# EAGLE design one_Mhz (EAGLE 7.7.0)
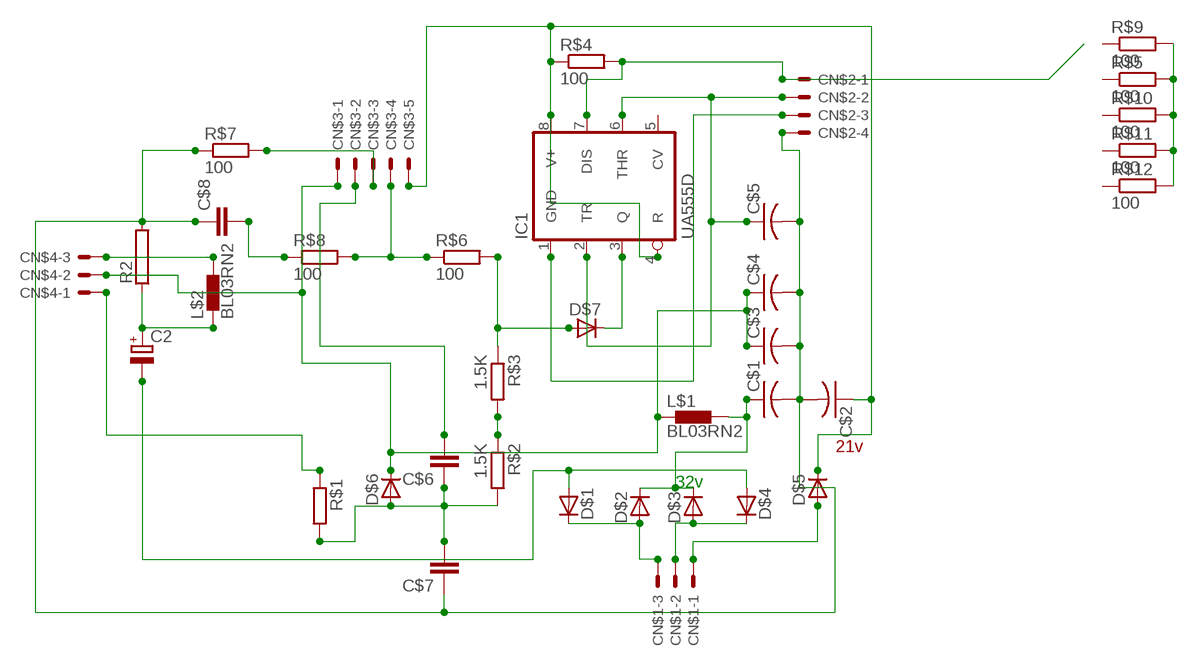
[diagram p0: schematic, sheet 1]

## Parts
C2  CPOL-EUSANYO_H  [SANYO-OSCON_H]
C$1  C-US050-075X075  [C050-075X075]
C$2  C-US050-075X075  [C050-075X075]
C$3  C-US025-050X050  [C025-050X050]
C$4  C-US025-050X050  [C025-050X050]
C$5  C-US025-050X050  [C025-050X050]
C$6  C7.5/3  [C7.5B3]
C$7  C7.5/3  [C7.5B3]
C$8  C2.5/5  [C2.5-5]
CN$1  KK-156-3  [KK-156-3]
CN$2  KK-156-4  [KK-156-4]
CN$3  KK-156-5  [KK-156-5]
CN$4  KK-156-3  [KK-156-3]
D$1  D-SOD-87  [SOD87]
D$2  D-SOD-87  [SOD87]
D$3  D-SOD-87  [SOD87]
D$4  D-SOD-87  [SOD87]
D$5  D-SOD-87  [SOD87]
D$6  D-SOD-87  [SOD87]
D$7  D-SOD-87  [SOD87]
IC1  UA555D  [SO08]
L$1  BL03RN2  [BL03RN2]
L$2  BL03RN2  [BL03RN2]
R2  RAC01  [AC01]
R$1  R-EU_R0603  [R0603]
R$2  1.5K  R-EU_R0603  [R0603]
R$3  1.5K  R-EU_R0603  [R0603]
R$4  100  R-EU_R0603  [R0603]
R$5  100  R-EU_R0603  [R0603]
R$6  100  R-EU_R0603  [R0603]
R$7  100  R-EU_R0603  [R0603]
R$8  100  R-EU_R0603  [R0603]
R$9  100  R-EU_R0603  [R0603]
R$10  100  R-EU_R0603  [R0603]
R$11  100  R-EU_R0603  [R0603]
R$12  100  R-EU_R0603  [R0603]

## Nets
N$1: C$3.1 C$4.1 CN$3.1 CN$4.2 D$6.1(C) L$1.1
N$2: CN$1.2 D$3.2(A) D$4.1(C)
N$6: CN$1.3 D$1.1(C) D$2.2(A)
N$7: C2.- D$1.2(A) D$4.2(A)
N$9: CN$1.1 D$5.2(A)
N$12: C$1.2 C$2.2 C$3.2 C$4.2 C$5.2 C$7.1 C$8.1 CN$2.4 R2.2 R$7.1
N$13: R$2.1 R$3.2
N$14: D$7.2(A) R$3.1 R$6.2
N$15: D$7.1(C) IC1.3(Q)
N$16: CN$3.4 R$6.1 R$8.2
N$17: C$8.2 R$8.1
N$19: C$5.1 CN$2.2 IC1.2(TR) IC1.6(THR)
N$20: CN$3.3 R$7.2
N$21: CN$4.3 L$2.2
N$22: C2.+ L$2.1 R2.1
N$23: R$5.2 R$9.2 R$10.2 R$11.2 R$12.2
N$24: C$6.2 CN$3.2
N$26: C$6.1 C$7.2 D$6.2(A) R$1.2 R$2.2
N$27: C$1.1 D$2.1(C) D$3.1(C) L$1.2
N$28: C$2.1 CN$3.5 D$5.1(C) IC1.4(R) IC1.8(V+) R$4.1
N$33: CN$4.1 R$1.1
N$35: CN$2.1 IC1.7(DIS) R$4.2
N$37: CN$2.3 IC1.1(GND)
Unconnected: IC1.5(CV) R$5.1 R$9.1 R$10.1 R$11.1 R$12.1

## Notes on the sheet
- 21v
- 32v

## Library data of the parts
C2 = rcl:CPOL-EU: POLARIZED CAPACITOR, European symbol
C$1-C$5 = resistor:C-US: CAPACITOR, American symbol
C$6-C$8 = capacitor-wima:C: CAPACITOR naming: grid - package width
CN$1 CN$4 = con-molex:KK-156-3: KK 156 HEADER Source: http://www.molex.com/pdm_docs/sd/026604100_sd.pdf; OC_FARNELL: unknown; OC_NEWARK: unknown
CN$2 = con-molex:KK-156-4: KK 156 HEADER Source: http://www.molex.com/pdm_docs/sd/026604100_sd.pdf; OC_FARNELL: unknown; OC_NEWARK: unknown
CN$3 = con-molex:KK-156-5: KK 156 HEADER Source: http://www.molex.com/pdm_docs/sd/026604100_sd.pdf; OC_FARNELL: unknown; OC_NEWARK: unknown
D$1-D$7 = semicon-smd-ipc:D-: DIODE unfilled
IC1 = linear:*555: TIMER
L$1 L$2 = inductors:BL0: Noise Suppression Products/EMI Suppression Filters, Lead EMIFIL(R) Inductor Type Source: http://www.murata.com .. BL01RN1_DS.pdf
R2 = resistor-power:R: Power Resitor; OC_FARNELL: unknown; OC_NEWARK: unknown
R$1-R$12 = rcl:R-EU_: RESISTOR, European symbol

## Board
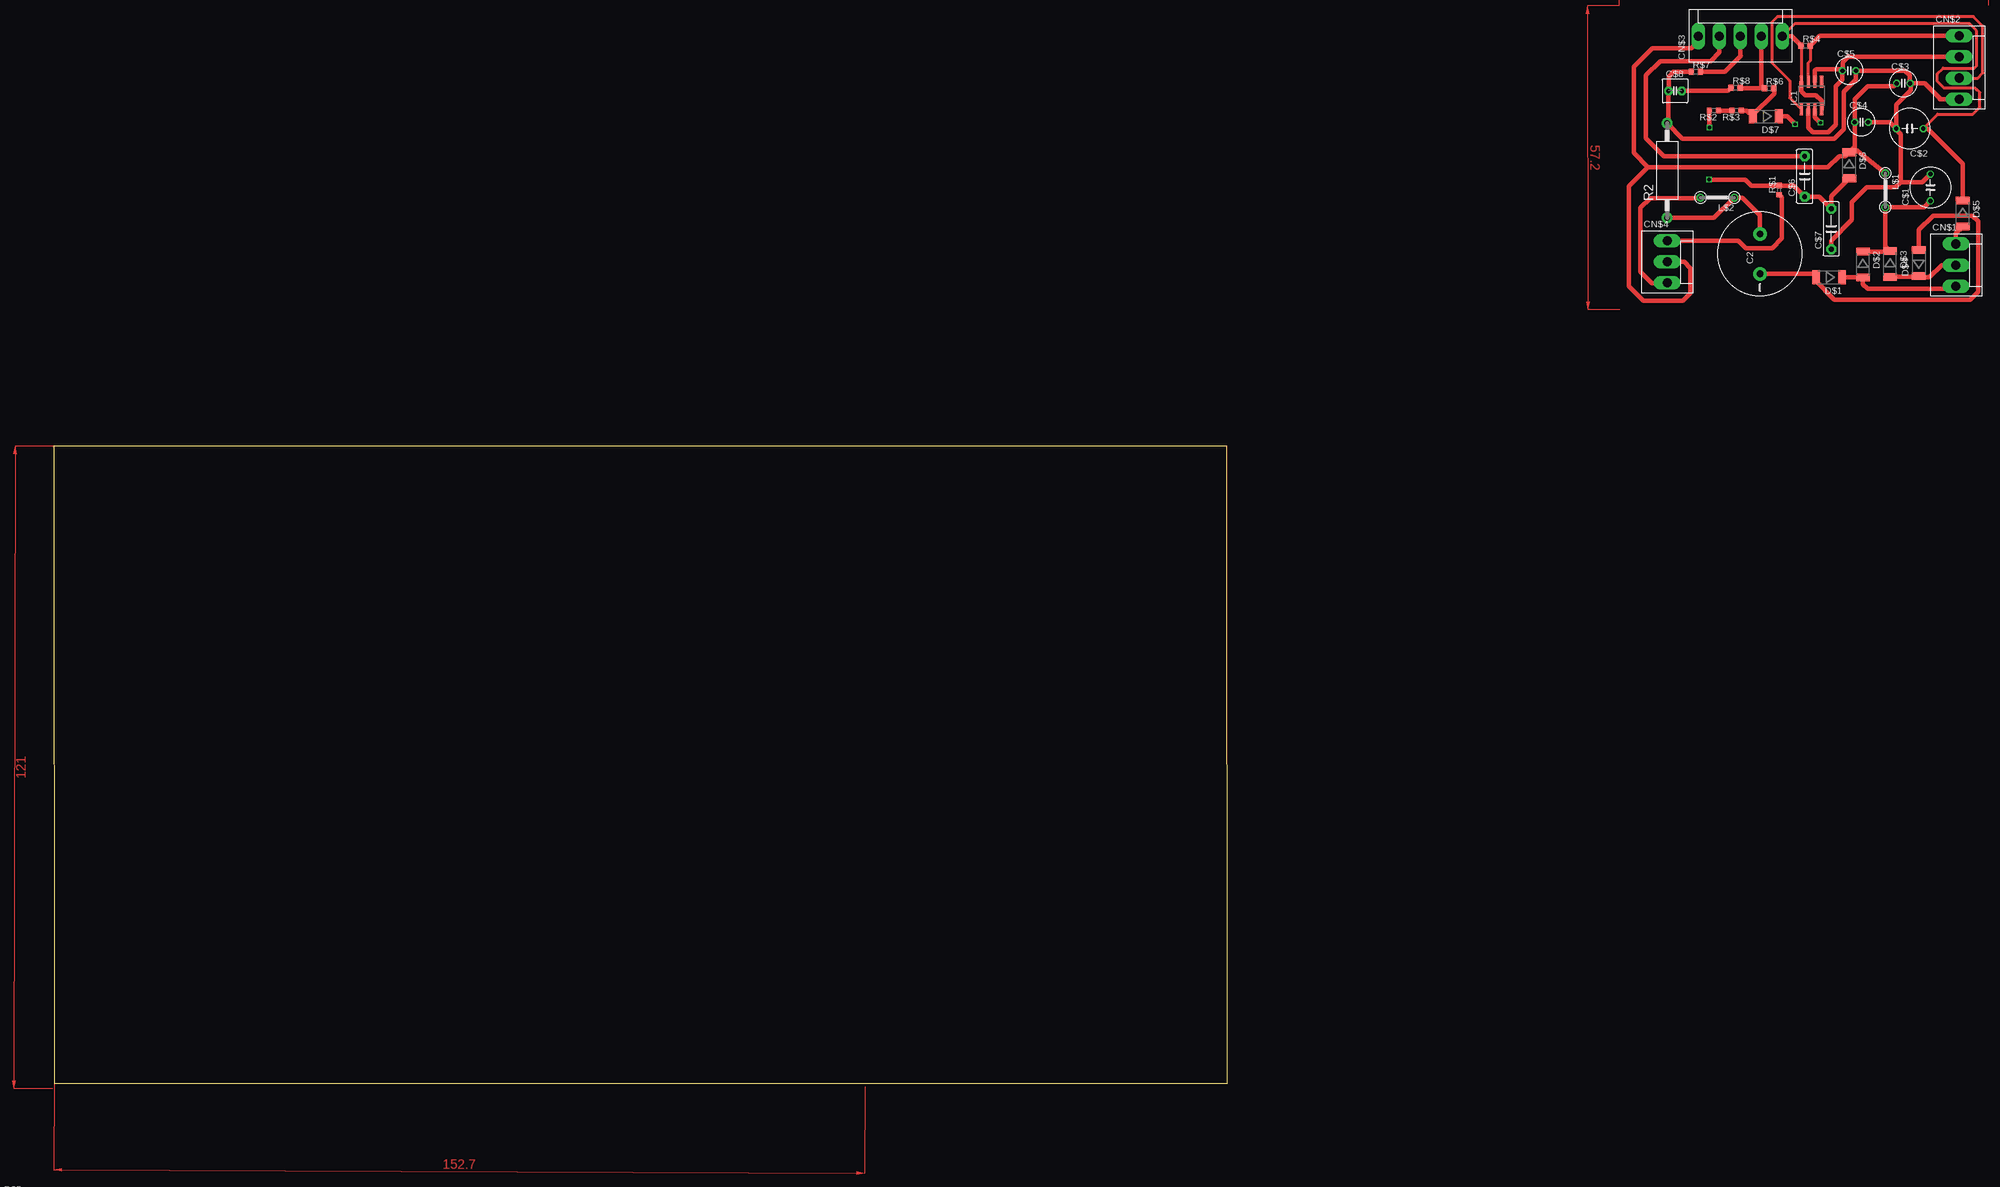
[diagram p1: board, top side]
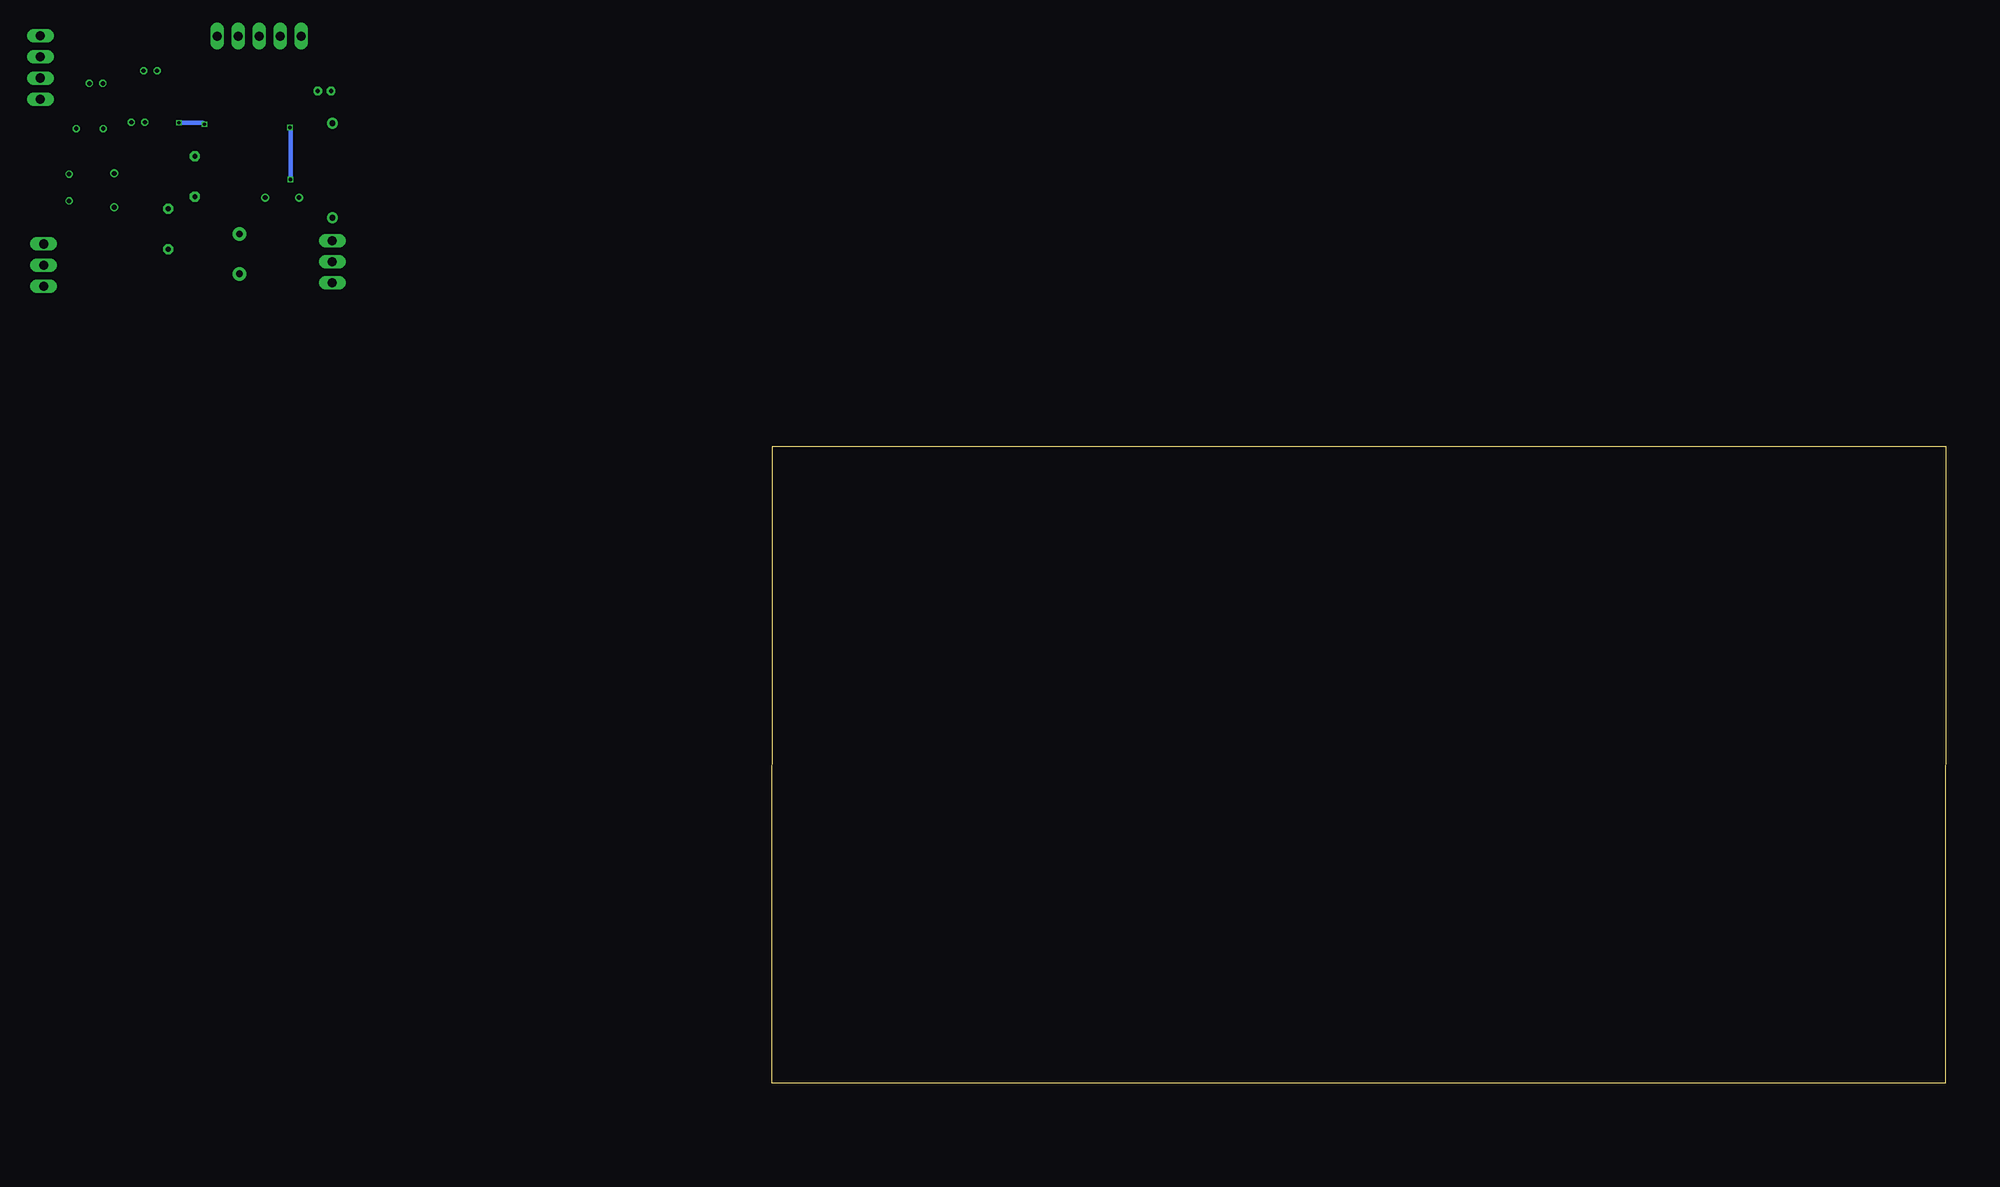
[diagram p2: board, bottom side, seen from below]

Size 221.06 x 120 mm. Coordinates in mm from the lower left corner, seen from the top.
Outline: 0.1,0 221.06,0 220.96,120 0,120 0.1,0
Copper layers (1*16): Top 0.035mm / dielectric 1.5mm / Bottom 0.035mm
Design rules "default": minimum track width 10mil, minimum drill 24mil, track to track 8mil, track to pad 8mil, pad to pad 8mil, via to via 8mil, smd to smd 8mil, copper to edge 40mil, drill to drill 8mil, minimum pad ring 10mil, minimum via ring 8mil, stop-mask expansion 4mil, vias tented up to drill 0mil, thermal gap 10mil

### Footprints (pad centres in the part's own frame; a part is rotated, then mirrored left to right if it is on the bottom)
SANYO-OSCON_H = drill 1.27 pad 2.54: + 3.75,0; - -3.75,0
C050-075X075 = drill 0.813 octagon: 1 -2.54,0; 2 2.54,0
C025-050X050 = drill 0.813 octagon: 1 -1.27,0; 2 1.27,0
C7.5B3 = drill 0.914 pad 1.905 octagon: 1 -3.81,0; 2 3.81,0
C2.5-5 = drill 0.813 pad 1.6 octagon: 1 -1.27,0; 2 1.27,0
KK-156-3 = drill 1.7 pad 2.184 long: 1 -3.96,0; 2 0,0; 3 3.96,0
KK-156-4 = drill 1.7 pad 2.184 long: 1 -5.94,0; 2 -1.98,0; 3 1.98,0; 4 5.94,0
KK-156-5 = drill 1.7 pad 2.184 long: 1 -7.92,0; 2 -3.96,0; 3 0,0; 4 3.96,0; 5 7.92,0
SOD87 = smd 1.45 x 2.6: 1 -2.445,0; 2 2.445,0
SO08 = smd 0.6 x 2.2: 1 -1.905,-2.6; 2 -0.635,-2.6; 3 0.635,-2.6; 4 1.905,-2.6; 5 1.905,2.6; 6 0.635,2.6; 7 -0.635,2.6; 8 -1.905,2.6
BL03RN2 = drill 0.9 pad 1.5: 1 -2.54,0; 2 3.81,0
AC01 = drill 1.1 pad 2: 1 -8.9,0; 2 8.9,0
R0603 = smd 1 x 1.1: 1 -0.85,0; 2 0.85,0

### Placement (x,y rotation side)
C2  321.4,156.2 90 top  (outside the outline)
C$1  353.5,168.7 90 top  (outside the outline)
C$2  349.6,179.8 180 top  (outside the outline)
C$3  348.4,188.3 0 top  (outside the outline)
C$4  340.5,181 0 top  (outside the outline)
C$5  338.2,190.7 0 top  (outside the outline)
C$6  329.8,170.8 90 top  (outside the outline)
C$7  334.8,160.9 90 top  (outside the outline)
C$8  305.4,186.9 0 top  (outside the outline)
CN$1  358.3,154.1 270 top  (outside the outline)
CN$2  358.9,191.3 270 top  (outside the outline)
CN$3  317.7,197.2 0 top  (outside the outline)
CN$4  303.9,154.7 270 top  (outside the outline)
D$1  334.4,151.8 180 top  (outside the outline)
D$2  340.8,154.2 270 top  (outside the outline)
D$3  345.9,154.3 270 top  (outside the outline)
D$4  351.3,154.5 90 top  (outside the outline)
D$5  359.6,163.8 270 top  (outside the outline)
D$6  338.2,172.9 270 top  (outside the outline)
D$7  322.5,182.1 180 top  (outside the outline)
IC1  331.1,186 0 top  (outside the outline)
L$1  345,168.8 270 top  (outside the outline)
L$2  314,166.8 180 top  (outside the outline)
R2  303.9,171.9 90 top  (outside the outline)
R$1  325,168.2 90 top  (outside the outline)
R$2  312.7,183.2 180 top  (outside the outline)
R$3  317,183.2 180 top  (outside the outline)
R$4  330,195.4 0 top  (outside the outline)
R$5  -8.8,-21.3 0 top  (outside the outline)
R$6  323.1,187.4 0 top  (outside the outline)
R$7  309.3,190.5 0 top  (outside the outline)
R$8  316.8,187.5 0 top  (outside the outline)
R$9  -8.8,-26.1 0 top  (outside the outline)
R$10  -8.8,-30.9 0 top  (outside the outline)
R$11  -8.8,-35.7 0 top  (outside the outline)
R$12  -8.8,-40.5 0 top  (outside the outline)

### Tracks (layer width: path | path; a pad name or v marks a point on that pad's centre or on a via)
N$1
  Top 0.813: CN$3.1 309.78,196.18 308.5,194.9 301.1,194.9 297.6,191.4 297.6,175.2 300.3,172.5 | CN$4.2 307.1,154.7 308.3,153.5 308.3,148.8 306.9,147.4 299.4,147.4 296.7,150.1 296.7,168.9 300.3,172.5 | 339.23,176.38 C$4.1 339.23,185.33 341.7,187.8 346.63,187.8 C$3.1 | 339.23,176.38 D$6.1 337.45,174.6 336.3,174.6 334.2,172.5 300.3,172.5 | 339.23,176.38 339.23,176.01 L$1.1
N$2
  Top 0.813: 351.8,151.8 351.56,151.8 D$4.1 | D$3.2 351.75,151.86 351.8,151.8 | CN$1.2 355.6,154.1 353.3,151.8 351.8,151.8
N$6
  Top 0.813: D$1.1 340.75,151.8 D$2.2 340.8,150.5 341.7,149.6 357.76,149.6 CN$1.3
N$7
  Top 0.813: C2.- 331.31,152.45 D$1.2 331.8,151.65 331.8,151.2 335.4,147.6 361,147.6 362.5,149.1 362.5,162.3 361.4,163.4 354,163.4 351.3,160.7 D$4.2
N$9
  Top 0.813: CN$1.1 358.3,160.06 D$5.2
N$12
  Top 0.813: R$7.1 305.1,190.5 304.2,189.6 304.2,186.97 C$8.1 304.13,181.03 R2.2 306.8,177.9 335.4,177.9 337.2,179.7 337.2,186.7 339.47,188.97 C$5.2 348.7,190.7 349.6,189.8 349.6,188.37 C$3.2 | CN$2.4 355.4,185.36 | 355.4,185.36 355.26,185.36 | C$3.2 352.46,188.3 355.4,185.36 | C$7.1 334.8,158.7 338.7,162.6 338.7,165.9 341.5,168.7 346.9,168.7 347.9,169.7 | C$4.2 345.86,181 C$2.2 | C$2.2 347.06,179.54 347.9,178.7 347.9,169.7 | C$2.2 347.06,184.26 349.8,187 349.8,188.17 C$3.2 | 347.9,169.7 351.96,169.7 C$1.2
N$13
  Top 0.813: R$3.2 R$2.1
N$14
  Top 0.813: R$6.2 324.1,187.25 324.1,186.4 320.06,182.36 D$7.2 318.95,183.2 R$3.1
N$15  (via drill 0.6)
  Top 0.813: IC1.3 331.74,181.97 v332.8,180.9 | D$7.1 326.5,182.1 v328,180.6
  Bottom 0.813: v332.8,180.9 328.3,180.9 v328,180.6
N$16
  Top 0.813: R$8.2 317.75,187.4 R$6.1 321.66,187.99 CN$3.4
N$17
  Top 0.813: C$8.2 315.35,186.9 R$8.1
N$19
  Top 0.813: IC1.6 331.74,190.74 332,191 336.63,191 C$5.1 | CN$2.2 337.98,193.28 337,192.3 337,190.77 C$5.1 | IC1.2 330.46,179.94 331.3,179.1 334.3,179.1 335.7,180.5 335.7,187.8 336.9,189 336.9,190.67 C$5.1
N$20
  Top 0.813: R$7.2 314.8,190.5 317.8,193.5 317.7,193.6 CN$3.3
N$21
  Top 0.813: CN$4.3 303.86,150.7 301,150.7 298.9,152.8 298.9,164.9 300.7,166.7 310.09,166.7 L$2.2
N$22
  Top 0.813: 321.4,163.7 321.4,163.5 | 321.4,163.5 C2.+ | R2.1 312.74,163 L$2.1 318.1,166.8 321.4,163.5
N$23  (4 unrouted)
N$24
  Top 0.813: CN$3.2 313.74,194.14 312.1,192.5 302.6,192.5 299.9,189.8 299.9,178 303.29,174.61 C$6.2
N$26  (via drill 0.6)
  Top 0.813: D$6.2 334.8,167.06 C$7.2 332.52,166.99 C$6.1 327.74,169.05 R$1.2 319.75,169.05 318.6,170.2 v311.8,170.2 | R$2.2 311.85,180.05 v311.9,180
  Bottom 0.813: v311.8,170.2 311.8,179.9 v311.9,180
N$27
  Top 0.813: D$2.1 345.8,156.65 D$3.1 345,157.65 L$1.2 352.33,164.99 C$1.1
N$28
  Top 0.61: CN$3.5 327.92,199.5 360.9,199.5 362.2,198.2 362.2,191.6 361.8,191.2 355.9,191.2 354.8,190.1 354.8,188.7 356.1,187.4 361.9,187.4 362.2,187.1 362.3,187.1 362.8,186.6 362.8,183.8 361.5,182.5 354.84,182.5 C$2.1 | R$4.1 329.15,188.65 IC1.8
  Top 0.813: CN$3.5 327.35,197.2 R$4.1 | IC1.8 329.19,186.81 329.9,186.1 331.9,186.1 333,185 IC1.4 | C$2.1 353,179.8 359.6,173.2 D$5.1
N$33
  Top 0.813: CN$4.1 317.34,158.66 318.7,157.3 323.7,157.3 325.5,159.1 325.5,166.85 R$1.1
N$35
  Top 0.61: R$4.2 330.85,192.55 330.4,192.1 330.4,188.67 IC1.7
  Top 0.813: CN$2.1 332.69,197.24 R$4.2
N$37
  Top 0.61: CN$2.3 362.42,189.32 363.4,190.3 363.4,199.1 361.6,200.9 324.7,200.9 323.6,199.8 323.6,192.2 327,188.8 327,185.59 IC1.1
(copper drawn outside any net)
  shapes: Top area x4